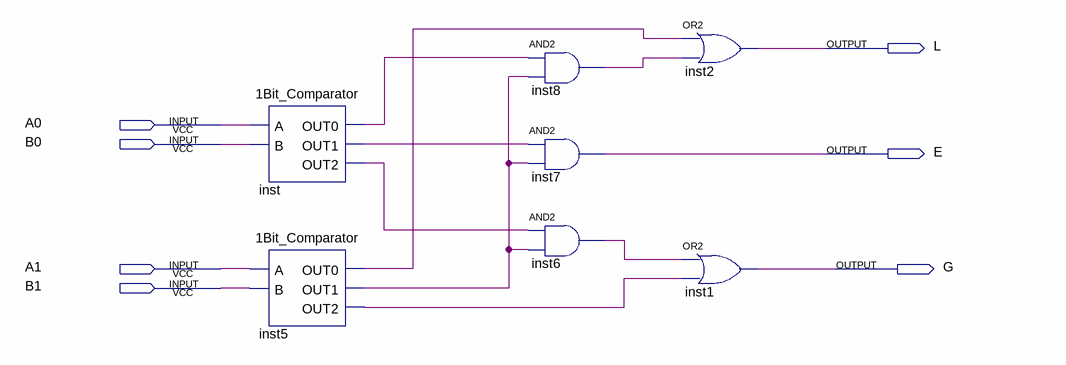
[diagram p0: schematic sheet]
// Quartus schematic 2Bit_Comparator.bdf as structural Verilog: 7 symbols, 7 pins
module \2Bit_Comparator  (
  input  A0,
  input  B0,
  input  A1,
  input  B1,
  output L,
  output E,
  output G
);

  wire inst5_out0, inst5_out1, inst5_out2, inst6_out, inst8_out, inst_out0, inst_out1, inst_out2;

  \1Bit_Comparator  inst (.A(A0), .B(B0), .OUT0(inst_out0), .OUT1(inst_out1), .OUT2(inst_out2));
  \1Bit_Comparator  inst5 (.A(A1), .B(B1), .OUT0(inst5_out0), .OUT1(inst5_out1), .OUT2(inst5_out2));
  and inst8 (inst8_out, inst_out0, inst5_out1);
  and inst7 (E, inst_out1, inst5_out1);
  and inst6 (inst6_out, inst_out2, inst5_out1);
  or inst2 (L, inst5_out0, inst8_out);
  or inst1 (G, inst6_out, inst5_out2);
endmodule
